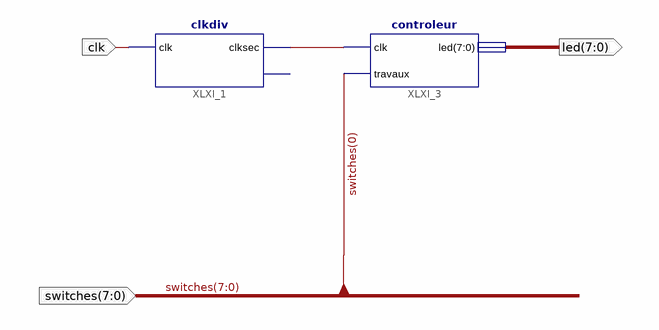
[diagram p0: schematic sheet 1]
// Xilinx ISE schematic toplevel.sch (spartan3e) as structural Verilog: 2 symbols, 3 ports
module toplevel (
  input  clk,
  input  [7:0] switches,
  output [7:0] led
);

  wire XLXN_5;

  clkdiv XLXI_1 (.clk(clk), .clksec(XLXN_5));  // open: clk190
  controleur XLXI_3 (.clk(XLXN_5), .travaux(switches[0]), .led(led));
endmodule
